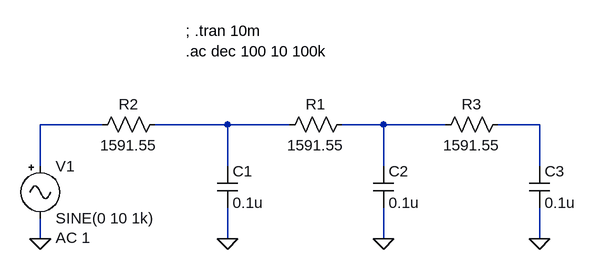
[diagram p0: schematic rc-filter.asc]
rc-filter.asc, the LTspice schematic file:
Version 4
SHEET 1 940 680
WIRE 208 320 112 320
WIRE 400 320 288 320
WIRE 496 320 400 320
WIRE 640 320 576 320
WIRE 736 320 640 320
WIRE 880 320 816 320
WIRE 112 384 112 320
WIRE 400 384 400 320
WIRE 640 384 640 320
WIRE 880 384 880 320
WIRE 112 496 112 464
WIRE 400 496 400 448
WIRE 640 496 640 448
WIRE 880 496 880 448
FLAG 112 496 0
FLAG 400 496 0
FLAG 640 496 0
FLAG 880 496 0
SYMBOL Misc/signal 112 368 R0
WINDOW 123 24 126 Left 2
SYMATTR InstName V1
SYMATTR Value SINE(0 10 1k)
SYMATTR Value2 AC 1
SYMBOL res 304 304 R90
WINDOW 0 0 56 VBottom 2
WINDOW 3 32 56 VTop 2
SYMATTR InstName R2
SYMATTR Value 1591.55
SYMBOL cap 384 384 R0
SYMATTR InstName C1
SYMATTR Value 0.1u
SYMBOL res 592 304 R90
WINDOW 0 0 56 VBottom 2
WINDOW 3 32 56 VTop 2
SYMATTR InstName R1
SYMATTR Value 1591.55
SYMBOL cap 624 384 R0
SYMATTR InstName C2
SYMATTR Value 0.1u
SYMBOL res 832 304 R90
WINDOW 0 0 56 VBottom 2
WINDOW 3 32 56 VTop 2
SYMATTR InstName R3
SYMATTR Value 1591.55
SYMBOL cap 864 384 R0
SYMATTR InstName C3
SYMATTR Value 0.1u
TEXT 336 176 Left 2 !; .tran 10m\n.ac dec 100 10 100k

The netlist it stands for:
* rc-filter.asc
V1 N001 0 SINE(0 10 1k) AC 1
R2 N002 N001 1591.55
C1 N002 0 0.1u
R1 N003 N002 1591.55
C2 N003 0 0.1u
R3 N004 N003 1591.55
C3 N004 0 0.1u
; .tran 10m
.ac dec 100 10 100k
.backanno
.end